# Altium project CONTROLLER_PROJECT.PrjPcb
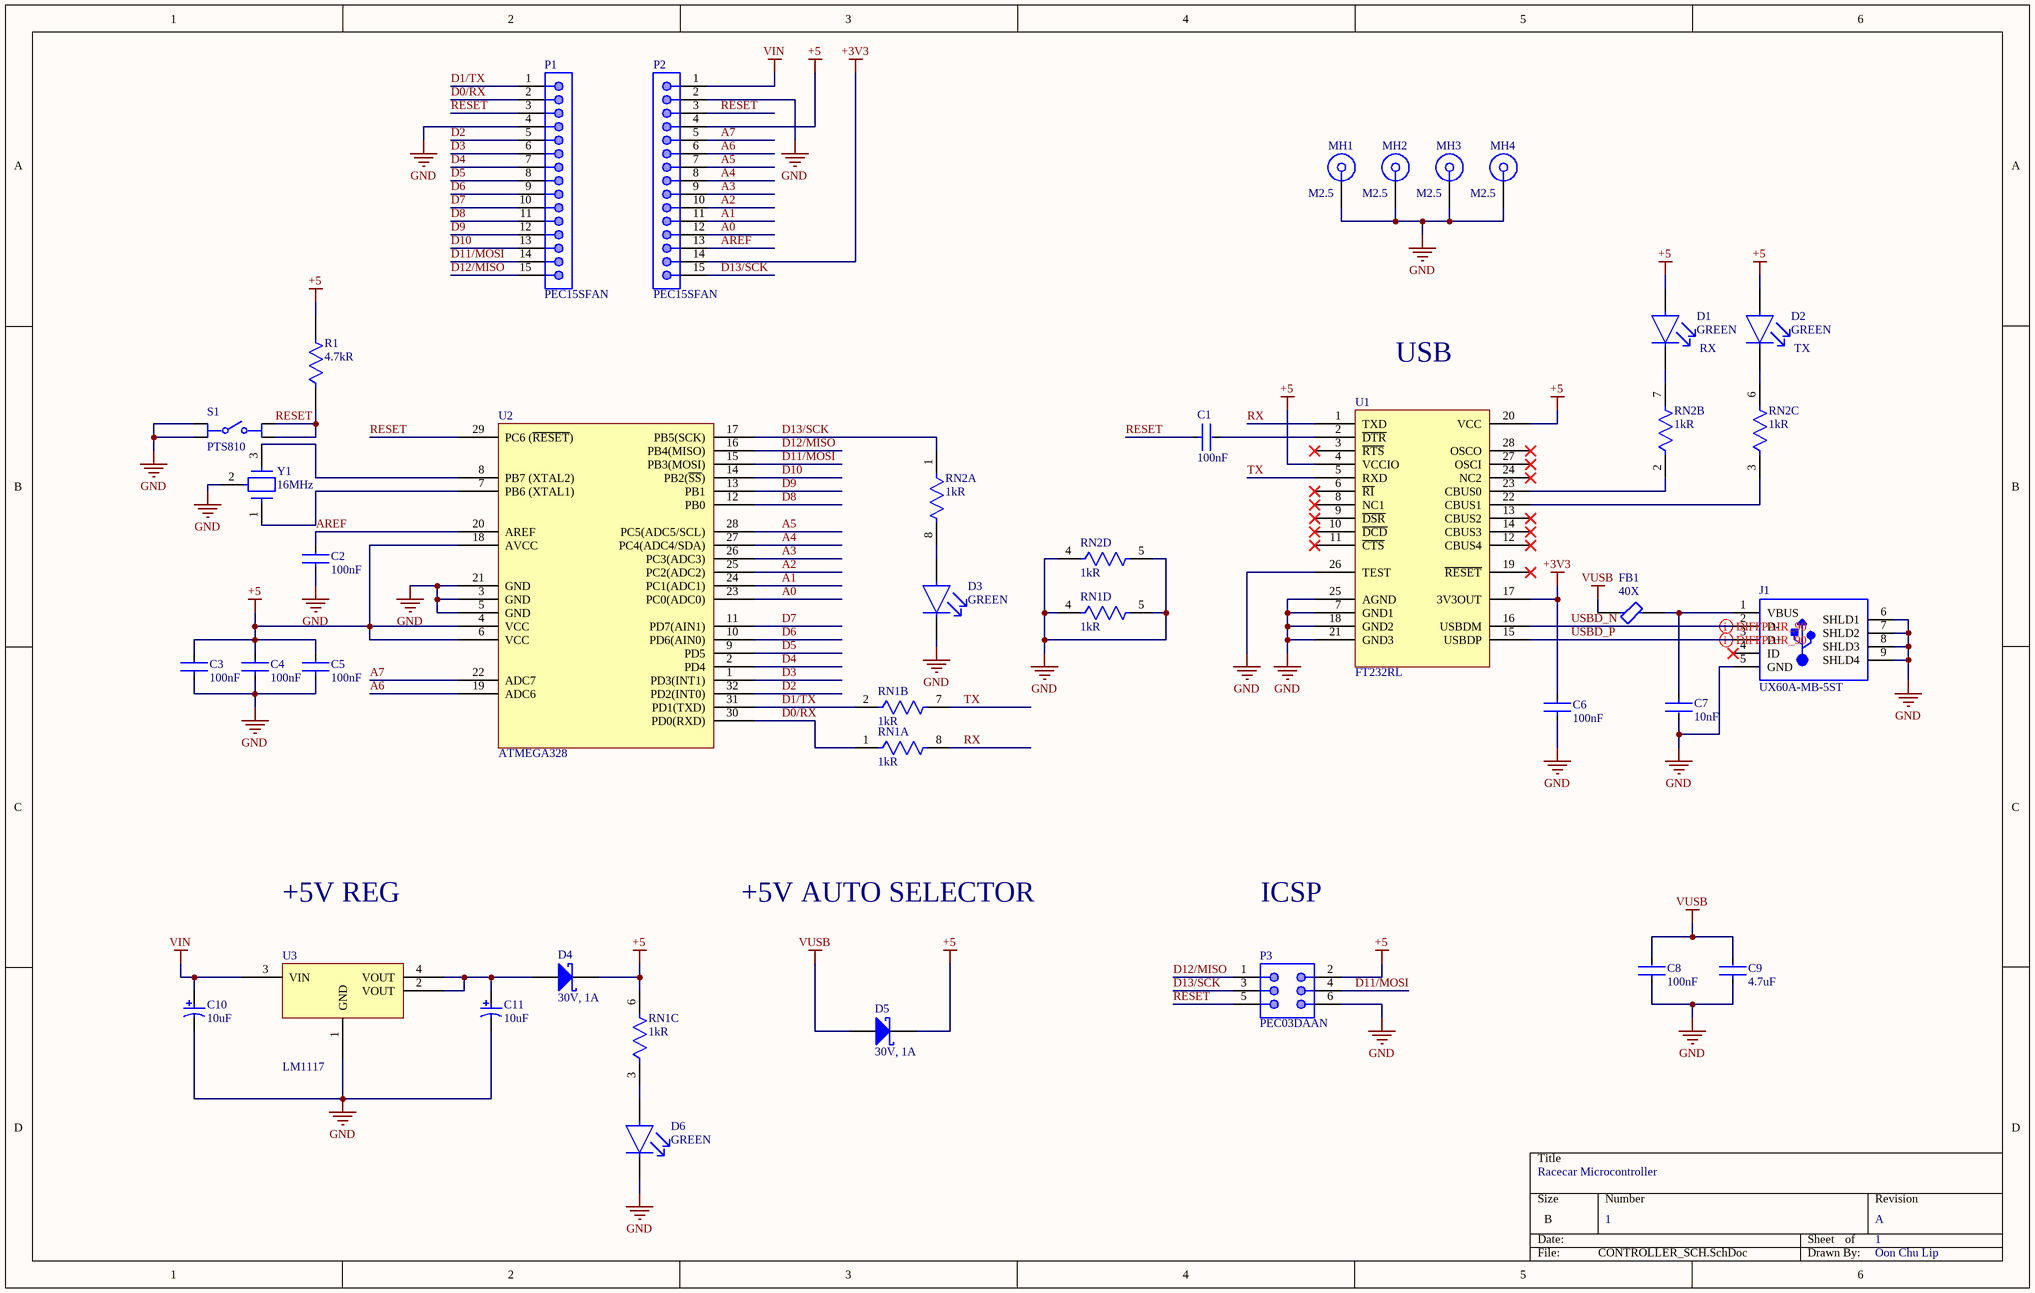
[diagram p0: CONTROLLER_SCH.SchDoc]
1 sheet, 34 parts. Net scope: global (net labels, ports and power ports of the same name join across sheets).
Board file: CONTROLLER_PCB.PcbDoc

## Sheet CONTROLLER_SCH.SchDoc: Racecar Microcontroller
size B; DrawnBy: Oon Chu Lip; Revision: A; SheetNumber: 1; SheetTotal: 1

### Parts
C1  100nF  [CAP_0603_TDK_CGA3]
C2  100nF  [CAP_0603_TDK_CGA3]
C3  100nF  [CAP_0603_TDK_CGA3]
C4  100nF  [CAP_0603_TDK_CGA3]
C5  100nF  [CAP_0603_TDK_CGA3]
C6  100nF  [CAP_0603_TDK_CGA3]
C7  10nF  [CAP_0603_MRT_GCM]
C8  100nF  [CAP_0603_TDK_CGA3]
C9  4.7uF  [CAP_0603_MRT_GRT]
C10  10uF  [PCAP_1411_VSH_TR3B]
C11  10uF  [PCAP_1411_VSH_TR3B]
D1  GREEN  [DIO_LED_GREEN_1608_APT1608]
D2  GREEN  [DIO_LED_GREEN_1608_APT1608]
D3  GREEN  [DIO_LED_GREEN_1608_APT1608]
D4  30V, 1A  [DIO_SCHOTTKY_DO_219AP]
D5  30V, 1A  [DIO_SCHOTTKY_DO_219AP]
D6  GREEN  [DIO_LED_GREEN_1608_APT1608]
FB1  40X  [FERRITE_0805_LRD_MI]
J1  UX60A-MB-5ST  [CONN_USB_MINIB_FEMALE_SMD_RA]
MH1  M2.5  [MH_M2.5]
MH2  M2.5  [MH_M2.5]
MH3  M2.5  [MH_M2.5]
MH4  M2.5  [MH_M2.5]
P1  PEC15SFAN  [CONN_HEADER_MALE_0.1_1x15]
P2  PEC15SFAN  [CONN_HEADER_MALE_0.1_1x15]
P3  PEC03DAAN  [CONN_HEADER_MALE_0.1_2x3]
R1  4.7kR  [RES_0603_RHM_ESR]
RN1  1kR  [RES_NET_0502_PNS_EXB]  (parts A,B,C,D of 4)
RN2  1kR  [RES_NET_0502_PNS_EXB]  (parts A,B,C,D of 4)
S1  PTS810  [SW_CAK_PTS810]
U1  FT232RL  [IC_SSOP_28]
U2  ATMEGA328  [IC_32_TQFP_32A]
U3  LM1117  [IC_SOT223_4_DCYRPDSOG4]
Y1  16MHz  [OSC_NONSTD_SMD3_MRT_CSTNE]

### Nets
+3V3: C6.2 P2.14 U1.17(3V3OUT)
+5: C3.2 C4.2 C5.2 D1.2 D2.2 D4.K D5.K P2.4 P3.2 R1.2 RN1.6 U1.4(VCCIO) U1.20(VCC) U2.4(VCC) U2.6(VCC) U2.18(AVCC)
GND: C2.1 C3.1 C4.1 C5.1 C6.1 C7.2 C8.1 C9.1 C10.2 C11.2 D3.1 D6.1 J1.5(GND) J1.6(SHLD1) J1.7(SHLD2) J1.8(SHLD3) J1.9(SHLD4) MH1.1 MH2.1 MH3.1 MH4.1 P1.4 P2.2 P3.6 RN1.4 RN1.5 RN2.4 RN2.5 S1.1 S1.2 U1.7(GND1) U1.18(GND2) U1.21(GND3) U1.25(AGND) U1.26(TEST) U2.3(GND) U2.5(GND) U2.21(GND) U3.1(GND) Y1.2(GND)
VIN: C10.1 P2.1 U3.3(VIN)
VUSB: C8.2 C9.2 D5.A FB1.1
A0: P2.12 U2.23(PC0(ADC0))
A1: P2.11 U2.24(PC1(ADC1))
A2: P2.10 U2.25(PC2(ADC2))
A3: P2.9 U2.26(PC3(ADC3))
A4: P2.8 U2.27(PC4(ADC4/SDA))
A5: P2.7 U2.28(PC5(ADC5/SCL))
A6: P2.6 U2.19(ADC6)
A7: P2.5 U2.22(ADC7)
AREF: C2.2 P2.13 U2.20(AREF)
D0/RX: P1.2 RN1.1 U2.30(PD0(RXD))
D1/TX: P1.1 RN1.2 U2.31(PD1(TXD))
D2: P1.5 U2.32(PD2(INT0))
D3: P1.6 U2.1(PD3(INT1))
D4: P1.7 U2.2(PD4)
D5: P1.8 U2.9(PD5)
D6: P1.9 U2.10(PD6(AIN0))
D7: P1.10 U2.11(PD7(AIN1))
D8: P1.11 U2.12(PB0)
D9: P1.12 U2.13(PB1)
D10: P1.13 U2.14(PB2(~{SS}))
D11/MOSI: P1.14 P3.4 U2.15(PB3(MOSI))
D12/MISO: P1.15 P3.1 U2.16(PB4(MISO))
D13/SCK: P2.15 P3.3 RN2.1 U2.17(PB5(SCK))
RESET: C1.1 P1.3 P2.3 P3.5 R1.1 S1.3 S1.4 U2.29(PC6_(~{RESET}))
RX: RN1.8 U1.1(TXD)
TX: RN1.7 U1.5(RXD)
USBD_N: J1.2(D-) U1.16(USBDM)
USBD_P: J1.3(D+) U1.15(USBDP)
NetC1_2: C1.2 U1.2(~{DTR})
NetC7_1: C7.1 FB1.2 J1.1(VBUS)
NetC11_1: C11.1 D4.A U3.2(VOUT) U3.4(VOUT)
NetD1_1: D1.1 RN2.7
NetD2_1: D2.1 RN2.6
NetD3_2: D3.2 RN2.8
NetD6_2: D6.2 RN1.3
NetRN2_2: RN2.2 U1.23(CBUS0)
NetRN2_3: RN2.3 U1.22(CBUS1)
NetU2_7: U2.7(PB6_(XTAL1)) Y1.1(Input)
NetU2_8: U2.8(PB7_(XTAL2)) Y1.3(Output)

Not connected (* = marked no-connect by the designer): J1 4(ID)*; U1 3(~{RTS})* 6(~{RI})* 8(NC1)* 9(~{DSR})* 10(~{DCD})* 11(~{CTS})* 12(CBUS4)* 13(CBUS2)* 14(CBUS3)* 19(~{RESET})* 24(NC2)* 27(OSCI)* 28(OSCO)*

### Layout directives
differential pair; differential pair class Diff_90: USBD_N, USBD_P

### Notes on the sheet
- USB
- RX
- (near D2) TX
- +5V REG
- +5V AUTO SELECTOR
- ICSP

### Library data of the parts
C1-C6 C8 = CAP_100nF_10%_50V: ±10% 50V Ceramic Capacitor X7R 0603 (1608 Metric); Manufacturer: TDK Corporation; Manufacturer Part Number: CGA3E2X7R1H104K080AA; Supplier 1: Digi-Key; Supplier Part Number 1: 445-5666-1-ND; Case/Package: 0603 (1608 Metric)
C7 = CAP_10nF_10%_100V: ±10% 100V Ceramic Capacitor X7R 0603 (1608 Metric); Manufacturer: Murata Electronics; Manufacturer Part Number: GCM188R72A103KA37D; Supplier 1: Digi-Key; Supplier Part Number 1: 490-4781-1-ND; Case/Package: 0603 (1608 Metric)
C9 = CAP_4.7uF_10%_25V: ±10% 25V Ceramic Capacitor X5R 0603 (1608 Metric); Manufacturer: Murata Electronics; Manufacturer Part Number: GRT188R61E475KE13D; Supplier 1: Digi-Key; Supplier Part Number 1: 490-12328-1-ND; Case/Package: 0603 (1608 Metric)
C10 C11 = PCAP_10uF_10%_25V: Molded Tantalum Capacitors 1411 (3528 Metric) 1.1Ohm; Manufacturer: Vishay Sprague; Manufacturer Part Number: TR3B106K025C1100; Supplier 1: Digi-Key; Supplier Part Number 1: 718-1312-1-ND; Case/Package: 1411 (3528 Metric)
D1-D3 D6 = DIO_LED_GREEN: Green 570nm LED Indication - Discrete 2.1V 0603 (1608 Metric); Manufacturer: Kingbright; Manufacturer Part Number: APT1608CGCK; Supplier 1: Digi-Key; Supplier Part Number 1: 754-1116-1-ND; Case/Package: 0603 (1608 Metric)
D4 D5 = DIO_SCHOTTKY_30V_1A: Diode Schottky 1A Surface Mount MicroSMP (DO-219AD); Manufacturer: Vishay General Semiconductor - Diodes Division; Manufacturer Part Number: MSS1P3L-M3/89A; Supplier 1: Digi-Key; Supplier Part Number 1: MSS1P3L-M3/89AGICT-ND; Case/Package: MicroSMP (DO-219AD)
FB1 = FERRITE_40X_1.5A: Power Line Ferrite Bead 0805 (2012 Metric) 1.5A 50mOhm; Manufacturer: Laird-Signal Integrity Products; Manufacturer Part Number: MI0805K400R-10; Supplier 1: Digi-Key; Supplier Part Number 1: 240-2389-1-ND; Case/Package: 0805 (2012 Metric)
J1 = CONN_USB_MINIB_FEMALE_SMD_RA: USB - mini B USB 2.0 Receptacle Connector 5 Position Surface Mount, Right Angle; Manufacturer: Hirose Electric Co LtdInc.; Manufacturer Part Number: UX60A-MB-5ST; Supplier 1: Digi-Key; Supplier Part Number 1: H2961CT-ND; Case/Package: USB - mini B
MH1-MH4 = MH_M2.5: M2.5 Mounting Hole
P1 P2 = CONN_VERT_HEADER_MALE_0.1_1x15: Connector Header Through Hole 15 position 0.100" (2.54mm); Manufacturer: Sullins Connector Solutions; Manufacturer Part Number: PEC15SFAN; Supplier 1: Digi-Key; Supplier Part Number 1: S1212E-15-ND; Case/Package: Header, Breakaway
P3 = CONN_VERT_HEADER_MALE_0.1_2x3: Connector Header Through Hole 6 position 0.100" (2.54mm); Manufacturer: Sullins Connector Solutions; Manufacturer Part Number: PEC03DAAN; Supplier 1: Digi-Key; Supplier Part Number 1: S2012E-03-ND; Case/Package: Header, Breakaway
R1 = RES_4.7kR_5%_0.25W: / ±5% 0.25W, 1/4W Chip Resistor 0603 (1608 Metric) Automotive AEC-Q200, Pulse Withstanding Thick Film; Manufacturer: Rohm Semiconductor; Manufacturer Part Number: ESR03EZPJ472; Supplier 1: Digi-Key; Supplier Part Number 1: RHM4.7KDCT-ND; Case/Package: 0603 (1608 Metric)
RN1 RN2 = RES_NET_1kR_5%_31mW: 1k Ohm ±5% 31mW Power Per Element Isolated 4 Resistor Network/Array ±200ppm/°C 0502 (1406 Metric), Long Side Terminals; Manufacturer: Panasonic Electronic Components; Manufacturer Part Number: EXB-18V102JX; Supplier 1: Digi-Key; Supplier Part Number 1: Y6102CT-ND; Case/Package: 0502 (1406 Metric), Long Side Terminal
S1 = SW_SPST_NO: Tactile Switch SPST-NO Top Actuated Surface Mount; Manufacturer: C&K; Manufacturer Part Number: PTS810 SJG 250 SMTR LFS; Supplier 1: Digi-Key; Supplier Part Number 1: CKN10504CT-ND; Case/Package: 4.20mm x 3.20mm
U1 = IC_FT232RL: USB Bridge, USB to UART USB 2.0 UART Interface 28-SSOP; Manufacturer: FTDI, Future Technology Devices International Ltd; Manufacturer Part Number: FT232RL-REEL; Supplier 1: Digi-Key; Supplier Part Number 1: 768-1007-1-ND; Case/Package: 28-SSOP (0.209", 5.30mm Width)
U2 = IC_ATMEGA328: 8-bit Microcontrollers - MCU AVR 32K FLSH 2K SRAM 1KB EE-20 MHZ 105C; Manufacturer: Microchip Technology / Atmel; Manufacturer Part Number: ATMEGA328P-AN; Supplier 1: Mouser Electronics; Supplier Part Number 1: 556-ATMEGA328P-AN; Case/Package: TQFP-32
U3 = IC_LM1117: Linear Voltage Regulator IC Positive Fixed Output 800mA SOT-223-4; Manufacturer: Texas Instruments; Manufacturer Part Number: LM1117IMPX-5.0/NOPB; Supplier 1: Digi-Key; Supplier Part Number 1: LM1117IMPX-5.0/NOPBCT-ND; Case/Package: TO-261-4, TO-261AA
Y1 = OSC_CER_16MHz: Ceramic Resonator Built in Capacitor ±0.15% -40°C ~ 125°C Surface Mount; Manufacturer: Murata Electronics; Manufacturer Part Number: CSTNE16M0V53C000R0; Supplier 1: Digi-Key; Supplier Part Number 1: 490-17949-1-ND; Case/Package: 3-SMD, Non-Standard